# EAGLE design Control (EAGLE 9.6.2)
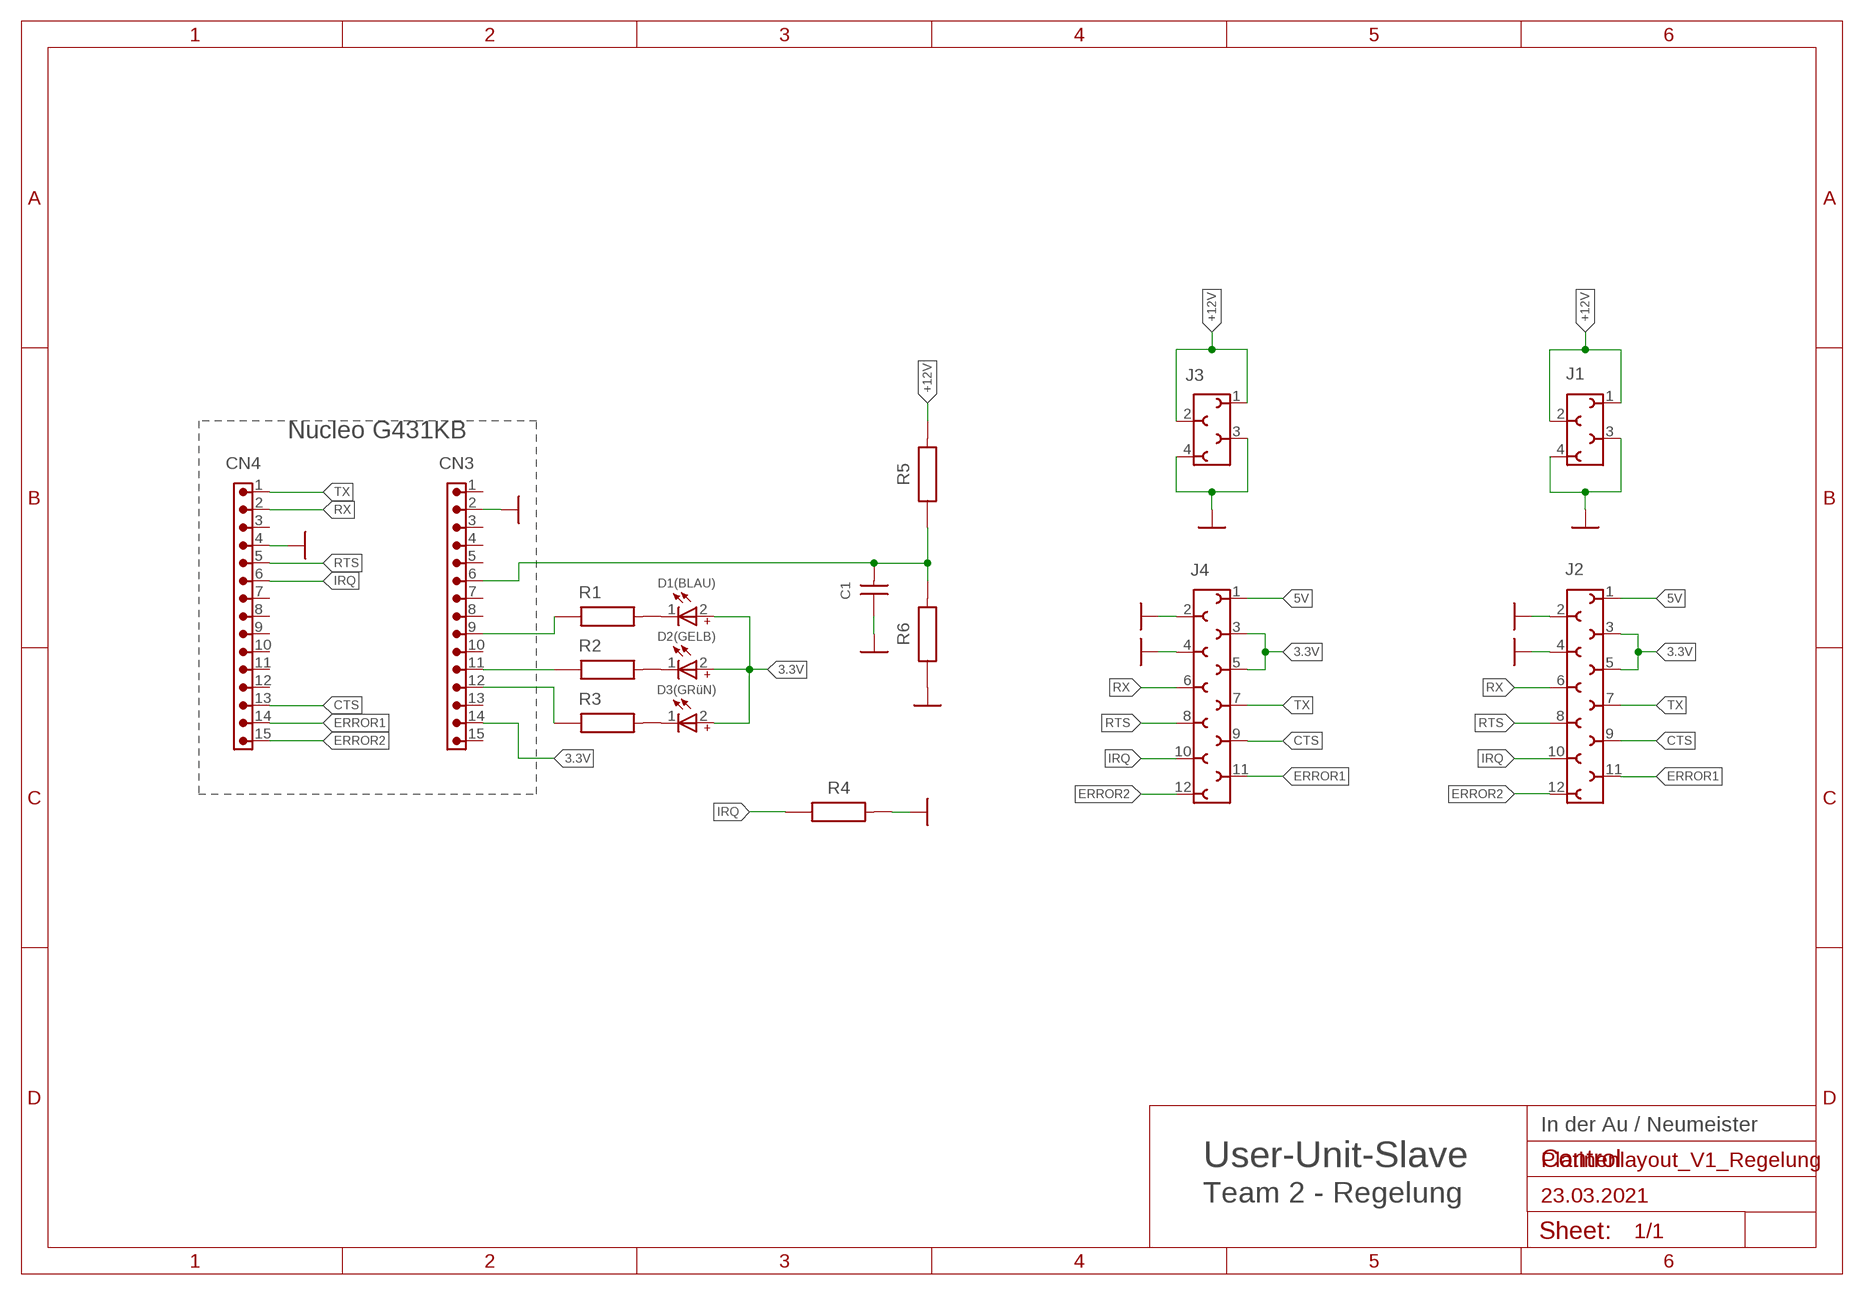
[diagram p0: schematic, sheet 1]

## Parts
C1  10 nF  WCAP-CSGP_1206_H1.25_885012008008_10V(DC)  [WCAP-CSGP_1206_H1.25]
CN3  61301511121  6130XX11121_61301511121  [61301511121]
CN4  61301511121  6130XX11121_61301511121  [61301511121]
D1(BLAU)  WL-TMRC_3MM_151031SS06000_WITHOUTSTOPPER  [WL-TMRC_3MM]
D2(GELB)  WL-TMRC_3MM_151031YS06000_WITHOUTSTOPPER  [WL-TMRC_3MM]
D3(GRüN)  WL-TMRC_3MM_151031VS06000_WITHOUTSTOPPER  [WL-TMRC_3MM]
J1  6100XX11921_61000411921  [61000411921]
J2  6100XX11921_61001211921  [61001211921]
J3  690367290476  [690367290476]
J4  690367291276  [690367291276]
R1  1Ohm  WRIS-KSKE_0805_560050320011_2.0X1.25X0.6  [WRIS-KSKE_0805_2.0X1.25X0.6(LXWXH)]
R2  1Ohm  WRIS-KSKE_0805_560050320011_2.0X1.25X0.6  [WRIS-KSKE_0805_2.0X1.25X0.6(LXWXH)]
R3  1Ohm  WRIS-KSKE_0805_560050320011_2.0X1.25X0.6  [WRIS-KSKE_0805_2.0X1.25X0.6(LXWXH)]
R4  0.1Ohm  WRIS-KSKE_0805_560050320001_2.0X1.25X0.6  [WRIS-KSKE_0805_2.0X1.25X0.6(LXWXH)]
R5  1Ohm  WRIS-KSKE_0805_560050320011_2.0X1.25X0.6  [WRIS-KSKE_0805_2.0X1.25X0.6(LXWXH)]
R6  1Ohm  WRIS-KSKE_0805_560050320011_2.0X1.25X0.6  [WRIS-KSKE_0805_2.0X1.25X0.6(LXWXH)]

## Nets
3.3V: CN3.14 D1(BLAU).2(+) D2(GELB).2(+) D3(GRüN).2(+) J2.3 J2.5 J4.3 J4.5
5V: J2.1 J4.1
+12V: J1.1 J1.2 J3.1 J3.2 R5.2
ADC-INPUT: C1.2 CN3.6 R5.1 R6.2
CTS: CN4.13 J2.9 J4.9
ERROR1: CN4.14 J2.11 J4.11
ERROR2: CN4.15 J2.12 J4.12
GND: C1.1 CN3.2 CN4.4 J1.3 J1.4 J2.2 J2.4 J3.3 J3.4 J4.2 J4.4 R4.2 R6.1
GPIO_D1: CN3.9 R1.1
GPIO_D2: CN3.11 R2.1
GPIO_D3: CN3.12 R3.1
IRQ: CN4.6 J2.10 J4.10 R4.1
N$5: D1(BLAU).1(-) R1.2
N$13: D2(GELB).1(-) R2.2
N$14: D3(GRüN).1(-) R3.2
RTS: CN4.5 J2.8 J4.8
RX: CN4.2 J2.6 J4.6
TX: CN4.1 J2.7 J4.7
Unconnected: CN3.1 CN3.3 CN3.4 CN3.5 CN3.7 CN3.8 CN3.10 CN3.13 CN3.15 CN4.3 CN4.7 CN4.8 CN4.9 CN4.10 CN4.11 CN4.12

## Notes on the sheet
- Nucleo G431KB
- In der Au / Neumeister
- User-Unit-Slave | Platinenlayout_V1_Regelung
- Team 2 - Regelung | 23.03.2021

## Library data of the parts
C1 = Eagle_WCAP-CSGP (rev20a):WCAP-CSGP_1206_H1.25: WCAP-CSGP MLCCs 1206 General Purpose Characteristics General purpose product series High performance ceramic High electrical precision and stability ceramic especially for NP0 Minimal aging especially for NP0 Mounting style: SMT-Chip Ceramic: NP0 (Class I), X5R (Class II), X7R (Class II) Capacitance range: 1 pF ‒ 100 µF Temperature Coefficient: ±30 ppm/°C; ±0.54 % for NP0 ±15 % for X7R and X5R Voltage range (UR): 6.3 ‒ 100 V(DC) Operating temperature: -55 °C up to + 125 °C for NP0 and X7R -55 °C up to + 85 °C for X5R Termination: Cu/Ni/Sn Recommended soldering: Reflow soldering Applications Temperature compensation (NP0) Coupling Decoupling Bypass Smoothing Filtering Resonant circuit <https://www.we-online.com/catalog/media/o166501v209%20Family_WE-MLCC_1206_dunkelbraun.jpg> Details see: https://www.we-online.com/catalog/en/WCAP-CSGP-1206/ Updated by yingchun,Shan;2020-03-09 2020(C) Würth Elektronik; CERAMIC-TYPE: NP0 Class I; DATASHEET-URL: https://www.we-online.com/catalog/datasheet/885012008008.pdf; DF: -; H: 1.25mm; OPERATING-TEMPERATURE: -55 °C up to +125 °C; PART-NUMBER: 885012008008; QMIN: 1000; RISO: 10GOhm; TECHNICAL-REFERENCE: NP01206103J010DFCT10000; TOL-VALUE: ±5%; VR: 10V(DC)
CN3 CN4 = Eagle_WR-PHD (rev19a):6130XX11121_61301511121: WR-PHD 2.54 mm THT Pin Header ARTICLE PROPERTIES: Pins:1;​ 2;​ 3;​ 4;​ 5;​ 6;​ 7;​ 8;​ 9;​ 10;​ 12;​ 13;​ 14;​ 15;​ 16;​ 18;​ 20;​ 22;​ 24;​ 25;​ 32;​ 36;​ 40 KIND PROPERTIES: Pitch：2.54 mm Quality Class:3 as per CECC 75 301-802 Rows：Single Gender：Pin Header Type：Straight MATERIAL PROPERTIES: Insulator Material :PBT Insulator Flammability Rating:UL94 V-0 Contact Material:Copper Alloy Contact Plating:Gold Contact Type:Stamped GENERAL INFORMATION Operating Temperature:-40 up to +105 °C Compliance:RoHS ELECTRICAL PROPERTIES: Rated Current:3 A IR 1:3 A Withstanding Voltage:500 V (AC) Contact Resistance:20 mΩ RISO:1000 MΩ CERTIFICATION UL Approval:E323964 PACKAGING PROPERTIES Packaging:Bag <https://katalog.we-online.com/media/images/v2/o33211v209%20Family_BTB_PHD_6130xx11121.jpg> Details see: https://katalog.we-online.com/en/em/PHD_2_54_THT_PIN_HEADER_6130XX11121 Updated by Yingchun,Shan 2019-10-16 2019 (C) Würth Elektronik; DATASHEET-URL: https://katalog.we-online.com/em/datasheet/61301511121.pdf; GENDER: Pin Header; IR: 3A; MATES: WR-PHD 2.54mm Angled Socket Header /SMT Socket Header/Socket Header; PACKAGING: Bag; PART-NUMBER: 61301511121; PINS: 15; ROWS: Single; TYPE: Straight
D1(BLAU) = Eagle_WL-TMRC (rev20b):WL-TMRC_3MM: WL-TMRC THT Mono-color Round Color Characteristics Low energy consumption High reliability Low current requirement Fast switching No UV/IR radiation Easy installation LED without stopper Variety of lens colors Variety of viewing angle Applications Status light Light guide design Commercial advertising Decorative lighting Interior and exterior lighting Outdoor LED panels Instrumentation and front panel indicator Traffic signal light Electronic and communication appliance Toys <https://www.we-online.com/catalog/media/o64621v209%20Family_WL_TMRC_THT.jpg> Details see: https://www.we-online.com/catalog/en/WL-TMRC/ Updated By Yingchun,Shan,2020-03-23 2020(C) Wurth Elektronik; ABSTRAHLWINKEL: 60°; CHIP-TECHNOLOGY: AlGaAs; DATASHEET-URL: https://www.we-online.com/catalog/datasheet/151031SS06000.pdf; EMITTING-COLOR: Super Red; I-V-TYP: 35mcd; LAMDA-DOM-TYP: 640nm; LAMDA-PEAK-TYP: 650nm; PART-NUMBER: 151031SS06000; SPICEPREFIX: D; V-F-TYP: 2.2V
D2(GELB) = Eagle_WL-TMRC (rev20b):WL-TMRC_3MM: WL-TMRC THT Mono-color Round Color Characteristics Low energy consumption High reliability Low current requirement Fast switching No UV/IR radiation Easy installation LED without stopper Variety of lens colors Variety of viewing angle Applications Status light Light guide design Commercial advertising Decorative lighting Interior and exterior lighting Outdoor LED panels Instrumentation and front panel indicator Traffic signal light Electronic and communication appliance Toys <https://www.we-online.com/catalog/media/o64621v209%20Family_WL_TMRC_THT.jpg> Details see: https://www.we-online.com/catalog/en/WL-TMRC/ Updated By Yingchun,Shan,2020-03-23 2020(C) Wurth Elektronik; ABSTRAHLWINKEL: 60°; CHIP-TECHNOLOGY: AlInGaP; DATASHEET-URL: https://www.we-online.com/catalog/datasheet/151031YS06000.pdf; EMITTING-COLOR: Yellow; I-V-TYP: 110mcd; LAMDA-DOM-TYP: 590nm; LAMDA-PEAK-TYP: 592nm; PART-NUMBER: 151031YS06000; V-F-TYP: 2V
D3(GRüN) = Eagle_WL-TMRC (rev20b):WL-TMRC_3MM: WL-TMRC THT Mono-color Round Color Characteristics Low energy consumption High reliability Low current requirement Fast switching No UV/IR radiation Easy installation LED without stopper Variety of lens colors Variety of viewing angle Applications Status light Light guide design Commercial advertising Decorative lighting Interior and exterior lighting Outdoor LED panels Instrumentation and front panel indicator Traffic signal light Electronic and communication appliance Toys <https://www.we-online.com/catalog/media/o64621v209%20Family_WL_TMRC_THT.jpg> Details see: https://www.we-online.com/catalog/en/WL-TMRC/ Updated By Yingchun,Shan,2020-03-23 2020(C) Wurth Elektronik; ABSTRAHLWINKEL: 60°; CHIP-TECHNOLOGY: GaAsP/GaP; DATASHEET-URL: https://www.we-online.com/catalog/datasheet/151031VS06000.pdf; EMITTING-COLOR: Bright Green; I-V-TYP: 30mcd; LAMDA-DOM-TYP: 568nm; LAMDA-PEAK-TYP: 560nm; PART-NUMBER: 151031VS06000; V-F-TYP: 2.2V
J1 = Eagle_WR-PHD (rev19a):6100XX11921_61000411921: WR-PHD 2.54 mm SMT Socket Header ARTICLE PROPERTIES: Pins:4;​ 5;​ 6;​ 8;​ 10;​ 12;​ 14;​ 16;​ 20;​ 24 KIND PROPERTIES: Pitch：2.54 mm Quality Class:3 as per CECC 75 301-802 Rows：Single Gender：Socket Header Type：Straight Type 1;​ Straight Type 2 MATERIAL PROPERTIES: Insulator Material :Nylon 46 Insulator Flammability Rating:UL94 V-0 Contact Material:Copper Alloy Contact Plating:Gold Contact Type:Stamped GENERAL INFORMATION Operating Temperature:-40 up to +125 °C Compliance:Lead free / RoHS ELECTRICAL PROPERTIES: Rated Current:3 A IR 1:3 A Withstanding Voltage:500 V (AC) Contact Resistance:20 mΩ RISO:1000 MΩ CERTIFICATION UL Approval:E323964 PACKAGING PROPERTIES Packaging:Tube <https://katalog.we-online.com/media/images/v2/o64612v209%20Family_WR-PHD_6100xx13321.jpg> Details see: https://katalog.we-online.com/en/em/PHD_2_54_SMT_SOCKET_HEADER_6100XXXXX21 Updated by Yingchun,Shan 2019-10-23 2019 (C) Würth Elektronik; DATASHEET-URL: https://katalog.we-online.com/em/datasheet/61000411921.pdf; GENDER: Socket Header; IR: 3A; MATES: WR-PHD 2.54mm SMT Pin Header/THT Angled Pin Header/THT Pin Header; PACKAGING: Tube; PART-NUMBER: 61000411921; PINS: 4; ROWS: Single; TYPE: Straight Type 1
J2 = Eagle_WR-PHD (rev19a):6100XX11921_61001211921: WR-PHD 2.54 mm SMT Socket Header ARTICLE PROPERTIES: Pins:4;​ 5;​ 6;​ 8;​ 10;​ 12;​ 14;​ 16;​ 20;​ 24 KIND PROPERTIES: Pitch：2.54 mm Quality Class:3 as per CECC 75 301-802 Rows：Single Gender：Socket Header Type：Straight Type 1;​ Straight Type 2 MATERIAL PROPERTIES: Insulator Material :Nylon 46 Insulator Flammability Rating:UL94 V-0 Contact Material:Copper Alloy Contact Plating:Gold Contact Type:Stamped GENERAL INFORMATION Operating Temperature:-40 up to +125 °C Compliance:Lead free / RoHS ELECTRICAL PROPERTIES: Rated Current:3 A IR 1:3 A Withstanding Voltage:500 V (AC) Contact Resistance:20 mΩ RISO:1000 MΩ CERTIFICATION UL Approval:E323964 PACKAGING PROPERTIES Packaging:Tube <https://katalog.we-online.com/media/images/v2/o64612v209%20Family_WR-PHD_6100xx13321.jpg> Details see: https://katalog.we-online.com/en/em/PHD_2_54_SMT_SOCKET_HEADER_6100XXXXX21 Updated by Yingchun,Shan 2019-10-23 2019 (C) Würth Elektronik; DATASHEET-URL: https://katalog.we-online.com/em/datasheet/61001211921.pdf; GENDER: Socket Header; IR: 3A; MATES: WR-PHD 2.54mm SMT Pin Header/THT Angled Pin Header/THT Pin Header; PACKAGING: Tube; PART-NUMBER: 61001211921; PINS: 12; ROWS: Single; TYPE: Straight Type 1
J3 = Eagle_WR-MM (rev20b):690367290476: WR-MM Female SMT Connector with Latch & Polarization KIND PROPERTIES: Pitch 2.54 mm Gender:Female MATERIAL PROPERTIES: Insulator Material:PA6T Insulator Flammability Rating UL94 V-0 Insulator Color:Red Contact Material :Phosphor Bronze Contact Plating :Mat Tin over Nickel Contact Type: Stamped GENERAL PROPERTIES: Operating Temperature:-40 °C up to +105 °C Compliance Lead free / RoHS ELECTRICAL PROPERTIES: Working Voltage 100 V (AC) Withstanding Voltage:500 V (AC) Contact Resistance: 10 mΩ Insulation Resistance:1000 MΩ PACKAGING PROPERTIES: cULus Approval:E323964 Packaging :Tape and Reel <https://katalog.we-online.com/media/images/v2/o33161v209%20WR-MiMo_69036729xx76.jpg> Details see: Web 1: https://katalog.we-online.com/en/em/MM_1_27_SMT_FEMALE_CONNECTOR_WITH_LATCH_AND_POLARIZATION_69036729XX76_2 Web2: https://katalog.we-online.com/en/em/MM_1_27_SMT_FEMALE_CONNECTOR_WITH_LATCH_AND_POLARIZATION_69036729XX76 Updated by Yingchun,Shan 2019-10-28 2019 (C) Würth Elektronik; DATASHEET-URL: https://www.we-online.com/catalog/datasheet/690367290476.pdf; GENDER: Female; IR: 1.5A; PACKAGING: Tape and Reel; PART-NUMBER: 690367290476; PINS: 4; PITCH: 2.54; TYPE: Straight
J4 = Eagle_WR-MM (rev20b):690367291276: WR-MM Female SMT Connector with Latch & Polarization KIND PROPERTIES: Pitch 2.54 mm Gender:Female MATERIAL PROPERTIES: Insulator Material:PA6T Insulator Flammability Rating UL94 V-0 Insulator Color:Red Contact Material :Phosphor Bronze Contact Plating :Mat Tin over Nickel Contact Type: Stamped GENERAL PROPERTIES: Operating Temperature:-40 °C up to +105 °C Compliance Lead free / RoHS ELECTRICAL PROPERTIES: Working Voltage 100 V (AC) Withstanding Voltage:500 V (AC) Contact Resistance: 10 mΩ Insulation Resistance:1000 MΩ PACKAGING PROPERTIES: cULus Approval:E323964 Packaging :Tape and Reel <https://katalog.we-online.com/media/images/v2/o33161v209%20WR-MiMo_69036729xx76.jpg> Details see: Web 1: https://katalog.we-online.com/en/em/MM_1_27_SMT_FEMALE_CONNECTOR_WITH_LATCH_AND_POLARIZATION_69036729XX76_2 Web2: https://katalog.we-online.com/en/em/MM_1_27_SMT_FEMALE_CONNECTOR_WITH_LATCH_AND_POLARIZATION_69036729XX76 Updated by Yingchun,Shan 2019-10-28 2019 (C) Würth Elektronik; DATASHEET-URL: https://www.we-online.com/catalog/datasheet/690367291276.pdf; GENDER: Female; IR: 1.5A; PACKAGING: Tape and Reel; PART-NUMBER: 690367291276; PINS: 12; PITCH: 2.54; TYPE: Straight
R1-R3 R5 R6 = Eagle_WRIS-KSKE (rev19a):WRIS-KSKE_0805: WRIS-KSKE Thick Film Resistors General Purpose Current Sensing Characteristics General purpose current sensing product series Mounting style: SMT-Chip (standard terminal) Resistance range: 50 mΩ ‒ 10 Ω Resistance tolerance: ±1 % Rated Power: 0.125 W ‒ 1 W TCR: ±100; +200; +250; +300 ppm/°C Operating temperature: -55 °C up to +155°C Sizes: 0402 / 0603 / 0805 / 1206 / 2010 / 2512 Recommended soldering: Reflow soldering Applications DC/DC converter Camera; night vision device Battery management for mobile phone Electric motor control Package name and Variant abbreviation: L X W X H =Length X Width X Height <https://katalog.we-online.com/media/images/v2/o135740v209%20Family_WRIS-KSKE.jpg> Details see: https://katalog.we-online.com/en/pbs/WRIS-KSKE Created by Ella Wu 2019-09-05 2019(C) Wurth Elektronik; DATASHEET-URL: https://katalog.we-online.de/pbs/datasheet/560050320011.pdf; IR: 0.57A; MOUNT: SMT; PART-NUMBER: 560050320011; PRATED: 0.33W; TCR: ±100ppm/ °C; TECHNICAL-REFERENCE: KE08051R00F103KAATP0000
R4 = Eagle_WRIS-KSKE (rev19a):WRIS-KSKE_0805: WRIS-KSKE Thick Film Resistors General Purpose Current Sensing Characteristics General purpose current sensing product series Mounting style: SMT-Chip (standard terminal) Resistance range: 50 mΩ ‒ 10 Ω Resistance tolerance: ±1 % Rated Power: 0.125 W ‒ 1 W TCR: ±100; +200; +250; +300 ppm/°C Operating temperature: -55 °C up to +155°C Sizes: 0402 / 0603 / 0805 / 1206 / 2010 / 2512 Recommended soldering: Reflow soldering Applications DC/DC converter Camera; night vision device Battery management for mobile phone Electric motor control Package name and Variant abbreviation: L X W X H =Length X Width X Height <https://katalog.we-online.com/media/images/v2/o135740v209%20Family_WRIS-KSKE.jpg> Details see: https://katalog.we-online.com/en/pbs/WRIS-KSKE Created by Ella Wu 2019-09-05 2019(C) Wurth Elektronik; DATASHEET-URL: https://katalog.we-online.de/pbs/datasheet/560050320001.pdf; IR: 1.81A; MOUNT: SMT; PART-NUMBER: 560050320001; PRATED: 0.33W; TCR: 250ppm/ °C; TECHNICAL-REFERENCE: KE0805R100F103LAATP0000

## Board
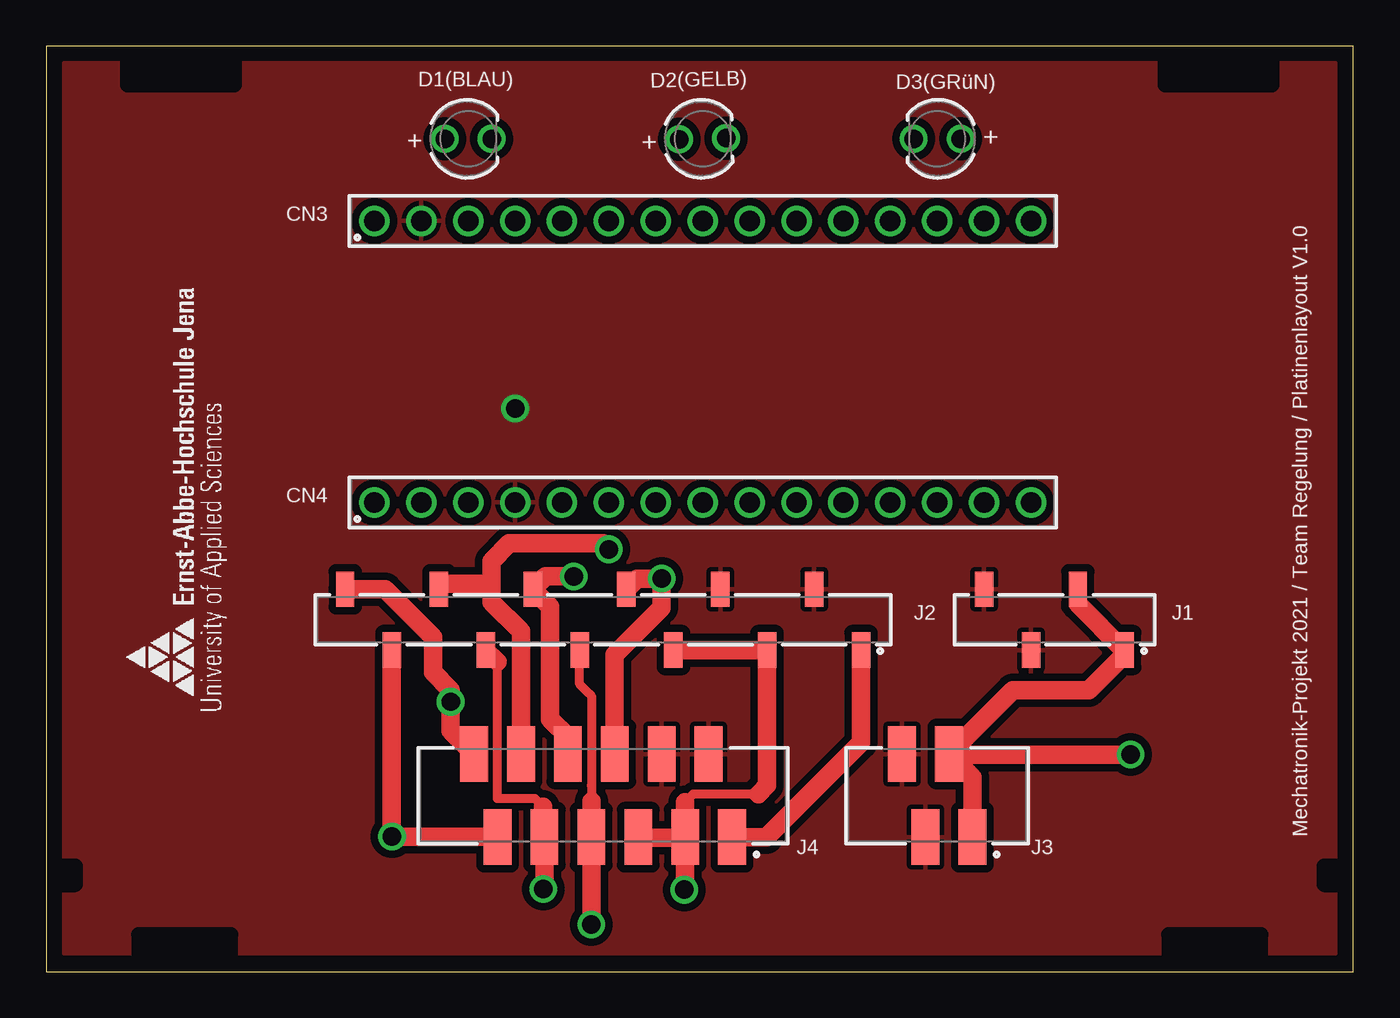
[diagram p1: board, top side]
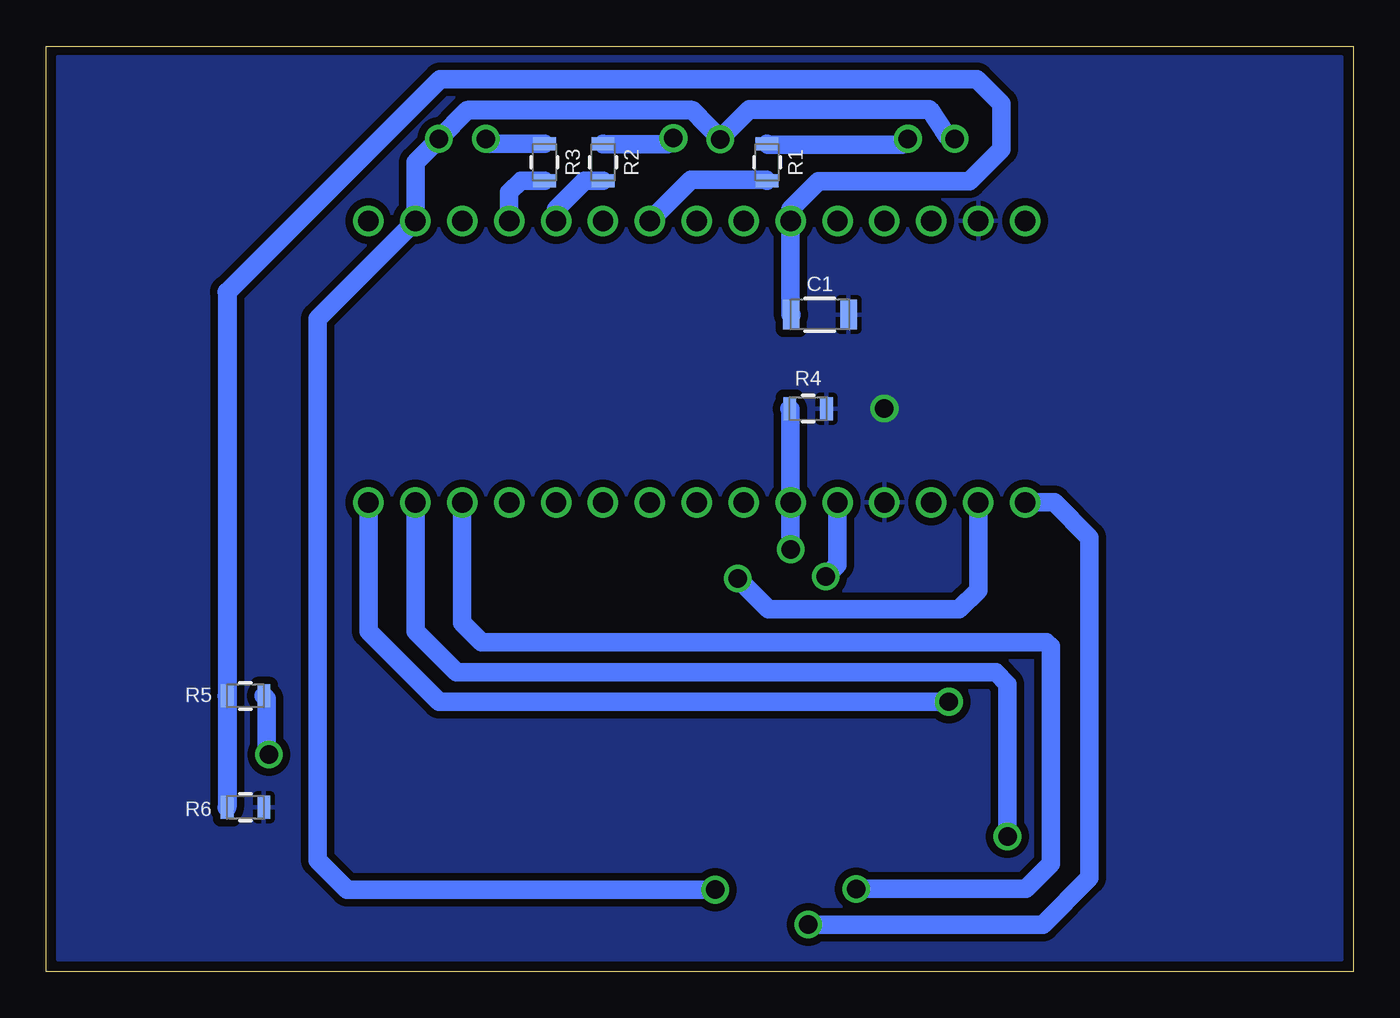
[diagram p2: board, bottom side, seen from below]

Size 70.8 x 50.1 mm. Coordinates in mm from the lower left corner, seen from the top.
Outline: 0,0 70.8,0 70.8,50.1 0,50.1 0,0
Copper layers (1*16): Top 0.035mm / dielectric 1.5mm / Bottom 0.035mm
Design rules "Elecrow_2-layer_eagle_rule": minimum track width 6mil, minimum drill 12mil, track to track 6mil, track to pad 6mil, pad to pad 6mil, via to via 6mil, smd to smd 0mil, copper to edge 10mil, drill to drill 10mil, minimum pad ring 10mil, minimum via ring 6mil, stop-mask expansion 2mil, vias tented up to drill 100mil, thermal gap 10mil
bKeepout: area 12.9,3.4 to 16.1,6.6; area 54.7,3.4 to 57.9,6.6; area 12.8,43.5 to 16,46.7; area 54.7,43.5 to 57.9,46.7
tRestrict: area 5,0 to 10,2; area 60.8,0 to 65.8,2; area 60.6,48 to 66.4,50; area 4.4,48 to 10.2,50; area 0,4.7 to 1.6,5.7; area 69.2,4.7 to 70.8,5.7

### Footprints (pad centres in the part's own frame; a part is rotated, then mirrored left to right if it is on the bottom)
WCAP-CSGP_1206_H1.25 = smd 0.9 x 1.6: 1 -1.55,0; 2 1.55,0
61301511121 = drill 1.1: 1 -17.78,0; 2 -15.24,0; 3 -12.7,0; 4 -10.16,0; 5 -7.62,0; 6 -5.08,0; 7 -2.54,0; 8 0,0; 9 2.54,0; 10 5.08,0; 11 7.62,0; 12 10.16,0; 13 12.7,0; 14 15.24,0; 15 17.78,0
WL-TMRC_3MM = drill 1: 1 1.27,0; 2 -1.27,0
61000411921 = smd 1 x 1.91: 1 3.81,-1.645; 2 1.27,1.645; 3 -1.27,-1.645; 4 -3.81,1.645
61001211921 = smd 1 x 1.91: 1 13.97,-1.645; 2 11.43,1.645; 3 8.89,-1.645; 4 6.35,1.645; 5 3.81,-1.645; 6 1.27,1.645; 7 -1.27,-1.645; 8 -3.81,1.645; 9 -6.35,-1.645; 10 -8.89,1.645; 11 -11.43,-1.645; 12 -13.97,1.645
690367290476 = smd 1.5 x 3: 1 1.905,-2.25; 2 0.635,2.25; 3 -0.635,-2.25; 4 -1.905,2.25
690367291276 = smd 1.5 x 3: 1 6.985,-2.25; 2 5.715,2.25; 3 4.445,-2.25; 4 3.175,2.25; 5 1.905,-2.25; 6 0.635,2.25; 7 -0.635,-2.25; 8 -1.905,2.25; 9 -3.175,-2.25; 10 -4.445,2.25; 11 -5.715,-2.25; 12 -6.985,2.25
WRIS-KSKE_0805_2.0X1.25X0.6(LXWXH) = smd 0.7 x 1.25: 1 -1,0; 2 1,0

### Placement (x,y rotation side)
C1  28.89,35.56 180 bottom
CN3  35.56,40.64 0 top
CN4  35.56,25.4 0 top
D1(BLAU)  22.86,45.09 0 top
D2(GELB)  35.56,45.09 1.5 top
D3(GRüN)  48.26,45.09 180 top
J1  54.61,19.05 0 top
J2  30.16,19.05 0 top
J3  48.26,9.53 0 top
J4  30.16,9.53 0 top
R1  31.75,43.81 90 bottom
R2  40.64,43.81 90 bottom
R3  43.81,43.81 90 bottom
R4  29.53,30.48 0 bottom
R5  60.01,14.92 0 bottom
R6  60.01,8.89 180 bottom

### Tracks (layer width: path | path; a pad name or v marks a point on that pad's centre or on a via)
3.3V  (via drill 1 pad 1)
  Top 0.5: 38.58,9.61 35.04,9.61 34.61,9.17
  Top 1: J2.5 J2.3 39.05,10.08 38.58,9.61 | J4.5 32.11,7.24 34.57,7.24 J4.3 | 34.61,9.17 J4.3 | J4.3 34.61,4.47 v34.57,4.43
  Bottom 1: 47.99,46.62 D3(GRüN).2 50.8,43.81 CN3.14 56.1,35.34 56.1,6.02 54.51,4.43 v34.57,4.43 | D2(GELB).2 34.29,45.09 32.7,46.67
  Bottom 1.016: D1(BLAU).2 22.03,45.27 22.97,46.67 32.7,46.67 | D2(GELB).2 34.29,45.09 35.79,46.62 47.99,46.62
5V
  Top 1: J4.1 39.02,7.28 44.13,12.38 J2.1
+12V  (via drill 1)
  Top 0.152: 55.88,19.91 J1.2
  Top 1: J3.2 50.16,10.51 J3.1 | v58.74,11.75 48.92,11.75 J3.2 | J3.2 52.36,15.24 56.47,15.24 58.42,17.19 J1.1 58.38,17.41 55.88,19.91
  Bottom 0.152: v58.74,11.75 58.85,11.86
  Bottom 1: R5.2 58.85,14.77 58.85,11.86
ADC-INPUT
  Bottom 1: 61.01,36.78 49.47,48.32 20.38,48.32 19.05,46.99 19.05,44.53 20.8,42.78 28.97,42.78 30.48,41.27 CN3.6 30.48,35.6 C1.2
  Bottom 1.016: 61.01,36.78 R5.1 R6.2
CTS  (via drill 1 pad 1)
  Top 0.5: 24.45,16.77 24.45,9.37 26.47,9.37 26.92,8.91
  Top 1: 24.45,16.77 J2.9 | v26.93,4.47 26.99,4.53 J4.9 27,7.29 27,8.07 26.92,8.15 26.92,8.91
  Bottom 1: v26.93,4.47 17.74,4.47 16.38,5.83 16.38,17.6 16.61,17.84 47.2,17.84 48.26,18.89 CN4.13
ERROR1  (via drill 1)
  Top 1: J4.11 24.42,7.3 v18.73,7.3 18.72,7.31 18.72,17.39 J2.11
  Bottom 1: v18.73,7.3 18.73,15.56 19.37,16.19 48.58,16.19 50.8,18.41 CN4.14
ERROR2  (via drill 1)
  Top 1: J2.12 18.36,20.7 20.95,18.1 20.95,16.19 21.91,15.24 v21.91,14.61 21.91,13.04 J4.12
  Bottom 1: CN4.15 53.34,18.41 49.53,14.61 v21.91,14.61
GND  (via drill 1)
  other vias: 25.4,30.48
  pour Bottom (isolate 0.406): 0.64,0.64 0.64,49.53 70.17,49.53 70.17,0.64
  pour Top (isolate 0.406): 0.95,35.88 0.95,0.95 69.85,0.95 69.85,49.21 0.95,49.21
GPIO_D1
  Bottom 1: CN3.9 35.88,42.86 31.8,42.86 R1.1
GPIO_D2
  Bottom 1: CN3.11 43.18,41.27 41.64,42.81 R2.1
GPIO_D3
  Bottom 1: CN3.12 45.72,42.18 45.09,42.81 R3.1
IRQ  (via drill 1)
  Top 1: v30.48,22.86 30.16,23.18 25.08,23.18 24.13,22.23 24.13,20.99 | J4.10 25.72,18.41 24.13,20 24.13,20.99 | J2.10 21.57,20.99 24.13,20.99
  Bottom 1: v30.48,22.86 CN4.6 30.48,30.43 R4.1
N$5
  Bottom 1: R1.2 31.7,44.77 24.45,44.77 D1(BLAU).1
N$13
  Bottom 1: R2.2 40.63,44.8 37.15,44.8 D2(GELB).1
N$14
  Bottom 1: D3(GRüN).1 46.72,44.81 R3.2
RTS  (via drill 1)
  Top 1: J4.8 28.26,12.7 27.3,13.65 27.3,19.74 J2.8 27.05,21.39 v28.57,21.39
  Bottom 1: v28.57,21.39 27.94,22.02 CN4.5
RX  (via drill 1)
  Top 1: J4.6 30.8,17.14 33.34,19.68 v33.34,21.27 32.01,21.27 J2.6
  Bottom 1: v33.34,21.27 31.67,19.6 21.35,19.6 20.32,20.64 CN4.2
TX  (via drill 1 pad 1)
  Top 0.5: 29.53,9.21 29.53,10.08 29.53,14.92 29.21,15.24 28.89,15.56 J2.7
  Top 1: 29.53,9.21 J4.7 v29.53,2.54
  Bottom 1: v29.53,2.54 16.83,2.54 14.29,5.08 14.29,23.5 16.19,25.4 CN4.1

### Text on the board
tNames: Mechatronik-Projekt 2021 / Team Regelung / Platinenlayout V1.0